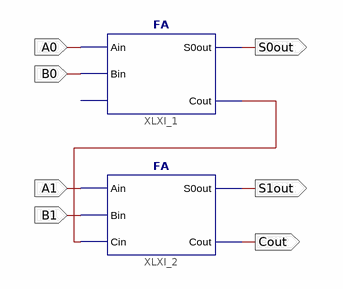
[diagram p0: schematic sheet 1]
// Xilinx ISE schematic addr2b.sch (spartan3e) as structural Verilog: 2 symbols, 7 ports
module addr2b (
  input  A0,
  input  B0,
  input  A1,
  input  B1,
  output S0out,
  output S1out,
  output Cout
);

  wire XLXN_8;

  FA XLXI_1 (.Ain(A0), .Bin(B0), .S0out(S0out), .Cout(XLXN_8));  // open: Cin
  FA XLXI_2 (.Ain(A1), .Bin(B1), .Cin(XLXN_8), .S0out(S1out), .Cout(Cout));
endmodule
